# EAGLE schematic Prototype_FCC_Board_82022 (EAGLE 9.6.2)

## Sheet 1 of 3: MCU
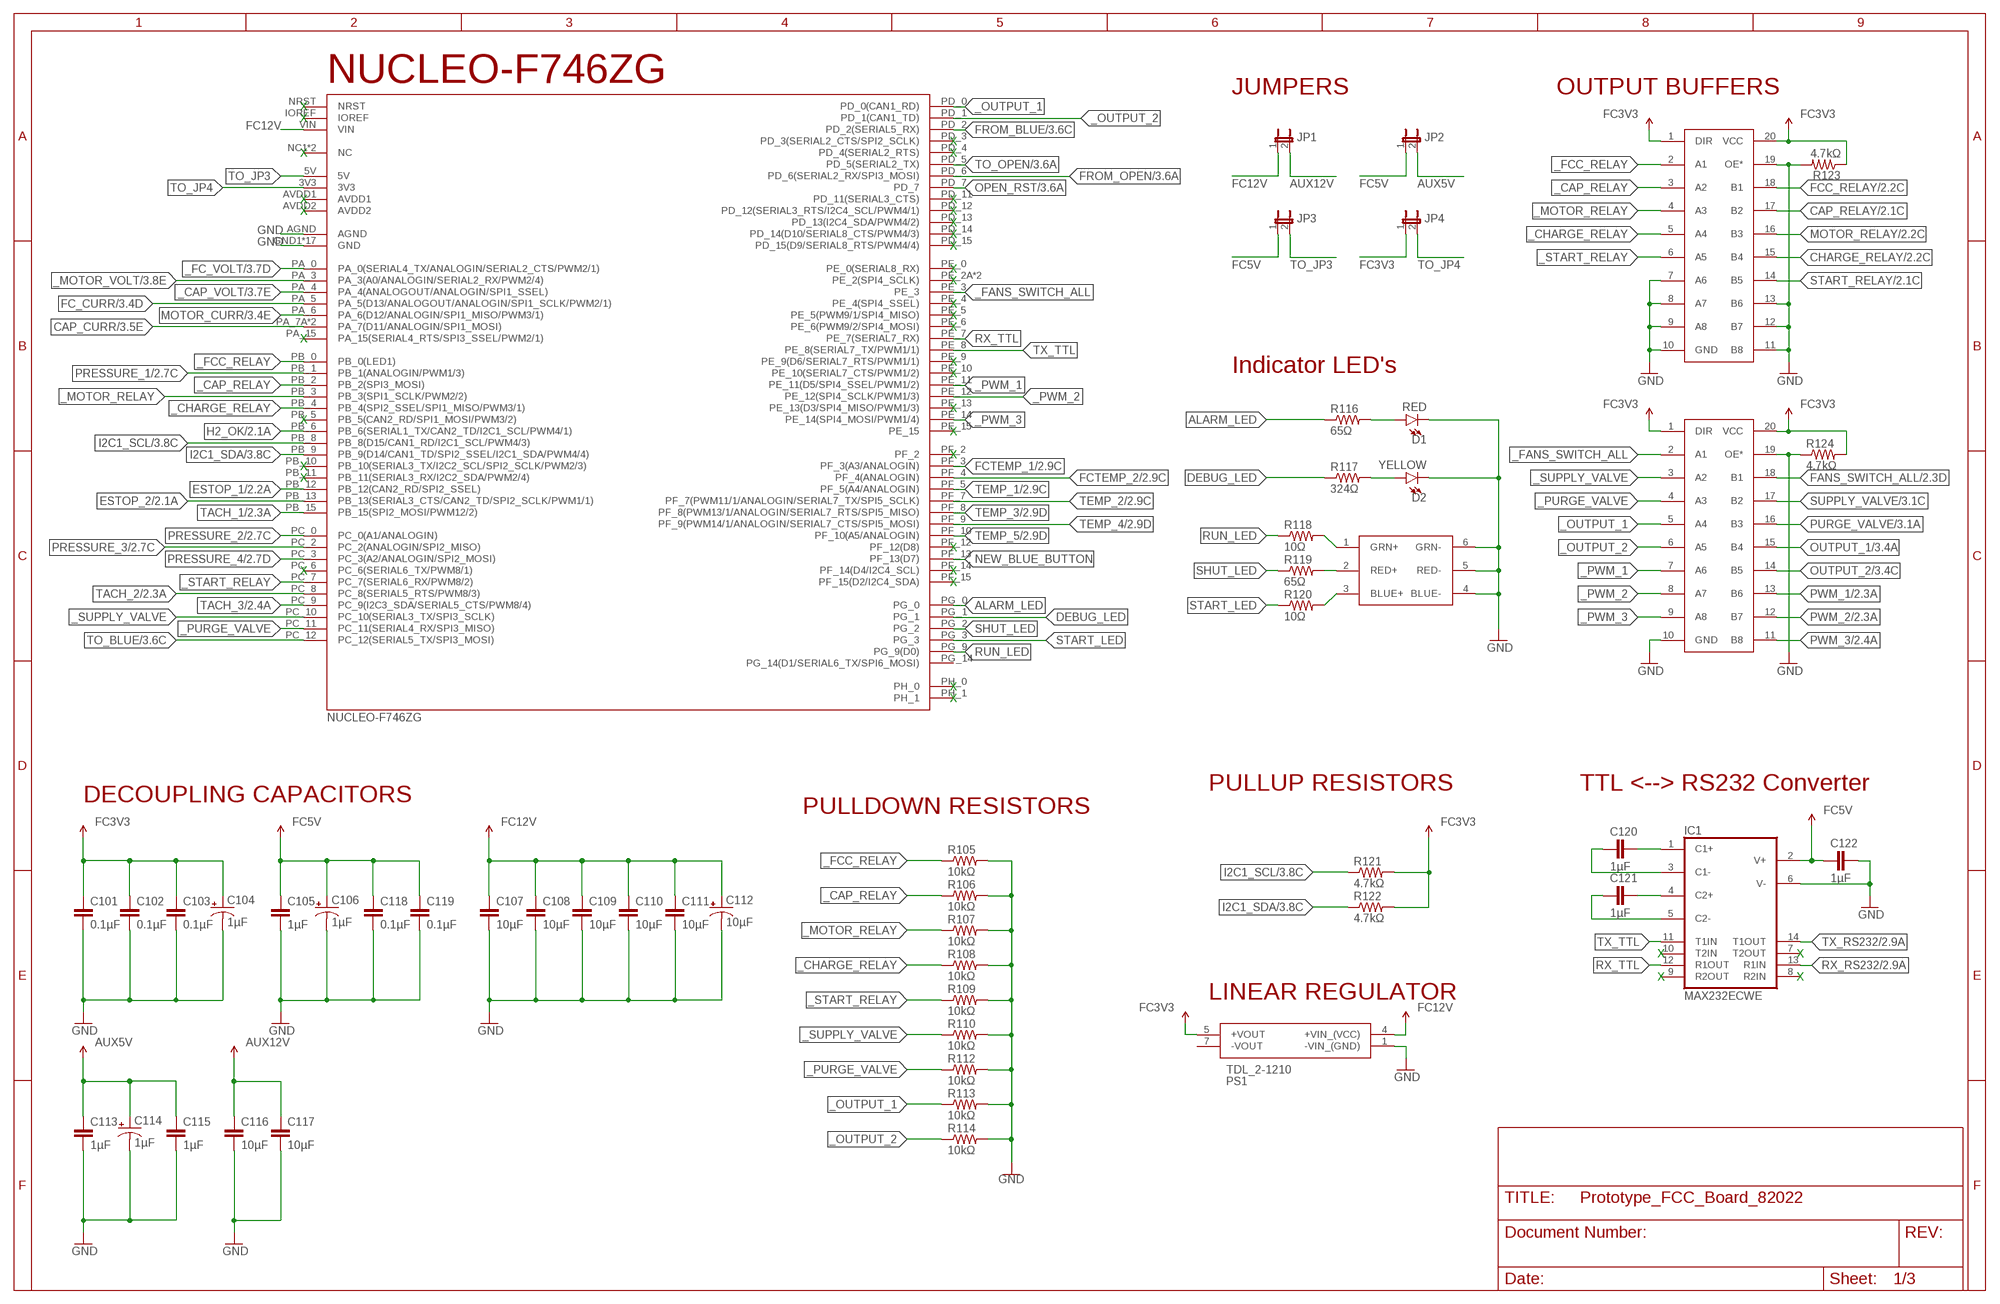
[diagram p0: schematic, sheet 1]

### Parts
C101  0.1µF  CAP0805  [0805]
C102  0.1µF  CAP0805  [0805]
C103  0.1µF  CAP0805  [0805]
C104  1µF  CAP-VS-SERIES-PACKAGE-E(ELECT)VS-SERIES-PACKAGE-E  [PANASONIC_D]
C105  1µF  CAP0805  [0805]
C106  1µF  CAP-VS-SERIES-PACKAGE-E(ELECT)VS-SERIES-PACKAGE-E  [PANASONIC_D]
C107  10µF  CAP0805  [0805]
C108  10µF  CAP0805  [0805]
C109  10µF  CAP0805  [0805]
C110  10µF  CAP0805  [0805]
C111  10µF  CAP0805  [0805]
C112  10µF  CAP-VS-SERIES-PACKAGE-E(ELECT)VS-SERIES-PACKAGE-E  [PANASONIC_D]
C113  1µF  CAP0805  [0805]
C114  1µF  CAP-VS-SERIES-PACKAGE-E(ELECT)VS-SERIES-PACKAGE-E  [PANASONIC_D]
C115  1µF  CAP0805  [0805]
C116  10µF  CAP0805  [0805]
C117  10µF  CAP0805  [0805]
C118  0.1µF  CAP0805  [0805]
C119  0.1µF  CAP0805  [0805]
C120  1µF  CAP0805  [0805]
C121  1µF  CAP0805  [0805]
C122  1µF  CAP0805  [0805]
D1  RED  LED1206  [LED-1206]
D2  YELLOW  LED1206  [LED-1206]
IC1  MAX232ECWE  [SO16L]
JP1  JP1E  [JP1]
JP2  JP1E  [JP1]
JP3  JP1E  [JP1]
JP4  JP1E  [JP1]
PS1  TDL_2-1210  [TDL21210]
R105  10kΩ  RESISTOR0805-RES  [0805]
R106  10kΩ  RESISTOR0805-RES  [0805]
R107  10kΩ  RESISTOR0805-RES  [0805]
R108  10kΩ  RESISTOR0805-RES  [0805]
R109  10kΩ  RESISTOR0805-RES  [0805]
R110  10kΩ  RESISTOR0805-RES  [0805]
R112  10kΩ  RESISTOR0805-RES  [0805]
R113  10kΩ  RESISTOR0805-RES  [0805]
R114  10kΩ  RESISTOR0805-RES  [0805]
R116  65Ω  RESISTOR0805-RES  [0805]
R117  324Ω  RESISTOR0805-RES  [0805]
R118  10Ω  RESISTOR0805-RES  [0805]
R119  65Ω  RESISTOR0805-RES  [0805]
R120  10Ω  RESISTOR0805-RES  [0805]
R121  4.7kΩ  RESISTOR0805-RES  [0805]
R122  4.7kΩ  RESISTOR0805-RES  [0805]
R123  4.7kΩ  RESISTOR0805-RES  [0805]
R124  4.7kΩ  RESISTOR0805-RES  [0805]
U$1  NUCLEO-F746ZGNUCLEO-F746ZG  [NUCLEO-F746ZG]
U$3  SN74LVC245AN  [DIL20]
U$5  SN74LVC245AN  [DIL20]
U$25  5060BRG45060BRG4  [5060BRG4]

### Nets
_CAP_RELAY: R106.1 U$1.PB_2(PB_2(SPI3_MOSI)) U$5.3(A2)
_CAP_VOLT: U$1.PA_4(PA_4(ANALOGOUT/ANALOGIN/SPI1_SSEL)) ; also sheet 3
_CHARGE_RELAY: R108.1 U$1.PB_4(PB_4(SPI2_SSEL/SPI1_MISO/PWM3/1)) U$5.5(A4)
_FANS_SWITCH_ALL: U$1.PE_3 U$3.2(A1)
_FC_VOLT: U$1.PA_0(PA_0(SERIAL4_TX/ANALOGIN/SERIAL2_CTS/PWM2/1)) ; also sheet 3
_FCC_RELAY: R105.1 U$1.PB_0(PB_0(LED1)) U$5.2(A1)
_MOTOR_RELAY: R107.1 U$1.PB_3(PB_3(SPI1_SCLK/PWM2/2)) U$5.4(A3)
_MOTOR_VOLT: U$1.PA_3(PA_3(A0/ANALOGIN/SERIAL2_RX/PWM2/4)) ; also sheet 3
_OUTPUT_1: R113.1 U$1.PD_0(PD_0(CAN1_RD)) U$3.5(A4)
_OUTPUT_2: R114.1 U$1.PD_1(PD_1(CAN1_TD)) U$3.6(A5)
_PURGE_VALVE: R112.1 U$1.PC_11(PC_11(SERIAL4_RX/SPI3_MISO)) U$3.4(A3)
_PWM_1: U$1.PE_11(PE_11(D5/SPI4_SSEL/PWM1/2)) U$3.7(A6)
_PWM_2: U$1.PE_12(PE_12(SPI4_SCLK/PWM1/3)) U$3.8(A7)
_PWM_3: U$1.PE_14(PE_14(SPI4_MOSI/PWM1/4)) U$3.9(A8)
_START_RELAY: R109.1 U$1.PC_7(PC_7(SERIAL6_RX/PWM8/2)) U$5.6(A5)
_SUPPLY_VALVE: R110.1 U$1.PC_10(PC_10(SERIAL3_TX/SPI3_SCLK)) U$3.3(A2)
ALARM_LED: R116.1 U$1.PG_0
AUX5V: C113.1 C114.+ C115.1 JP2.2 ; supply symbol labelled 5V ; also sheet 2,3
AUX12V: C116.1 C117.1 JP1.2 ; supply symbol labelled 5V ; also sheet 2,3
CAP_CURR: U$1.PA_7A(PA_7(D11/ANALOGIN/SPI1_MOSI)) U$1.PA_7B(PA_7(D11/ANALOGIN/SPI1_MOSI)) ; also sheet 3
CAP_RELAY: U$5.17(B2) ; also sheet 2
CHARGE_RELAY: U$5.15(B4) ; also sheet 2
DEBUG_LED: R117.1 U$1.PG_1
ESTOP_1: U$1.PB_12(PB_12(CAN2_RD/SPI2_SSEL)) ; also sheet 2
ESTOP_2: U$1.PB_13(PB_13(SERIAL3_CTS/CAN2_TD/SPI2_SCLK/PWM1/1)) ; also sheet 2
FANS_SWITCH_ALL: U$3.18(B1) ; also sheet 2
FC3V3: C101.1 C102.1 C103.1 C104.+ JP4.1 PS1.5(+VOUT) R121.2 R122.2 R123.1 R124.2 U$3.1(DIR) U$3.20(VCC) U$5.1(DIR) U$5.20(VCC) ; supply symbol labelled 5V ; also sheet 2,3
FC5V: C105.1 C106.+ C118.1 C119.1 C122.2 IC1.2(V+) JP2.1 JP3.1 ; supply symbol labelled 5V ; also sheet 2,3
FC12V: C107.1 C108.1 C109.1 C110.1 C111.1 C112.+ JP1.1 PS1.4(+VIN_(VCC)) U$1.VIN ; supply symbol labelled 5V ; also sheet 2,3
FC_CURR: U$1.PA_5(PA_5(D13/ANALOGOUT/ANALOGIN/SPI1_SCLK/PWM2/1)) ; also sheet 3
FCC_RELAY: U$5.18(B1) ; also sheet 2
FCTEMP_1: U$1.PF_3(PF_3(A3/ANALOGIN)) ; also sheet 2
FCTEMP_2: U$1.PF_4(PF_4(ANALOGIN)) ; also sheet 2
FROM_BLUE: U$1.PD_2(PD_2(SERIAL5_RX)) ; also sheet 3
FROM_OPEN: U$1.PD_6(PD_6(SERIAL2_RX/SPI3_MOSI)) ; also sheet 3
GND: C101.2 C102.2 C103.2 C104.- C105.2 C106.- C107.2 C108.2 C109.2 C110.2 C111.2 C112.- C113.2 C114.- C115.2 C116.2 C117.2 C118.2 C119.2 C122.1 D1.C D2.C IC1.6(V-) PS1.1(-VIN_(GND)) R105.2 R106.2 R107.2 R108.2 R109.2 R110.2 R112.2 R113.2 R114.2 R123.2 R124.1 U$1.AGND U$1.GND1(GND) U$1.GND2(GND) U$1.GND3(GND) U$1.GND4(GND) U$1.GND5(GND) U$1.GND6(GND) U$1.GND7(GND) U$1.GND8(GND) U$1.GND9(GND) U$1.GND10(GND) U$1.GND11(GND) U$1.GND12(GND) U$1.GND13(GND) U$1.GND14(GND) U$1.GND15(GND) U$1.GND16(GND) U$1.GND17(GND) U$3.10(GND) U$3.19(OE*) U$5.7(A6) U$5.8(A7) U$5.9(A8) U$5.10(GND) U$5.11(B8) U$5.12(B7) U$5.13(B6) U$5.19(OE*) U$25.4(BLUE-) U$25.5(RED-) U$25.6(GRN-) ; also sheet 2,3
H2_OK: U$1.PB_6(PB_6(SERIAL1_TX/CAN2_TD/I2C1_SCL/PWM4/1)) ; also sheet 2
I2C1_SCL: R121.1 U$1.PB_8(PB_8(D15/CAN1_RD/I2C1_SCL/PWM4/3)) ; also sheet 3
I2C1_SDA: R122.1 U$1.PB_9(PB_9(D14/CAN1_TD/SPI2_SSEL/I2C1_SDA/PWM4/4)) ; also sheet 3
MOTOR_CURR: U$1.PA_6(PA_6(D12/ANALOGIN/SPI1_MISO/PWM3/1)) ; also sheet 3
MOTOR_RELAY: U$5.16(B3) ; also sheet 2
N$16: D1.A R116.2
N$17: D2.A R117.2
N$18: R118.2 U$25.1(GRN+)
N$19: R119.2 U$25.2(RED+)
N$20: R120.2 U$25.3(BLUE+)
N$21: C120.1 IC1.1(C1+)
N$22: C120.2 IC1.3(C1-)
N$23: C121.2 IC1.4(C2+)
N$24: C121.1 IC1.5(C2-)
NEW_BLUE_BUTTON: U$1.PF_13(PF_13(D7))
OPEN_RST: U$1.PD_7 ; also sheet 3
OUTPUT_1: U$3.15(B4) ; also sheet 3
OUTPUT_2: U$3.14(B5) ; also sheet 3
PRESSURE_1: U$1.PB_1(PB_1(ANALOGIN/PWM1/3)) ; also sheet 2
PRESSURE_2: U$1.PC_0(PC_0(A1/ANALOGIN)) ; also sheet 2
PRESSURE_3: U$1.PC_2(PC_2(ANALOGIN/SPI2_MISO)) ; also sheet 2
PRESSURE_4: U$1.PC_3(PC_3(A2/ANALOGIN/SPI2_MOSI)) ; also sheet 2
PURGE_VALVE: U$3.16(B3) ; also sheet 3
PWM_1: U$3.13(B6) ; also sheet 2
PWM_2: U$3.12(B7) ; also sheet 2
PWM_3: U$3.11(B8) ; also sheet 2
RUN_LED: R118.1 U$1.PG_9(PG_9(D0))
RX_RS232: IC1.13(R1IN) ; also sheet 2
RX_TTL: IC1.12(R1OUT) U$1.PE_7(PE_7(SERIAL7_RX))
SHUT_LED: R119.1 U$1.PG_2
START_LED: R120.1 U$1.PG_3
START_RELAY: U$5.14(B5) ; also sheet 2
SUPPLY_VALVE: U$3.17(B2) ; also sheet 3
TACH_1: U$1.PB_15(PB_15(SPI2_MOSI/PWM12/2)) ; also sheet 2
TACH_2: U$1.PC_8(PC_8(SERIAL5_RTS/PWM8/3)) ; also sheet 2
TACH_3: U$1.PC_9(PC_9(I2C3_SDA/SERIAL5_CTS/PWM8/4)) ; also sheet 2
TEMP_1: U$1.PF_5(PF_5(A4/ANALOGIN)) ; also sheet 2
TEMP_2: U$1.PF_7(PF_7(PWM11/1/ANALOGIN/SERIAL7_TX/SPI5_SCLK)) ; also sheet 2
TEMP_3: U$1.PF_8(PF_8(PWM13/1/ANALOGIN/SERIAL7_RTS/SPI5_MISO)) ; also sheet 2
TEMP_4: U$1.PF_9(PF_9(PWM14/1/ANALOGIN/SERIAL7_CTS/SPI5_MOSI)) ; also sheet 2
TEMP_5: U$1.PF_10(PF_10(A5/ANALOGIN)) ; also sheet 2
TO_BLUE: U$1.PC_12(PC_12(SERIAL5_TX/SPI3_MOSI)) ; also sheet 3
TO_JP3: JP3.2 U$1.5V
TO_JP4: JP4.2 U$1.3V3
TO_OPEN: U$1.PD_5(PD_5(SERIAL2_TX)) ; also sheet 3
TX_RS232: IC1.14(T1OUT) ; also sheet 2
TX_TTL: IC1.11(T1IN) U$1.PE_8(PE_8(SERIAL7_TX/PWM1/1))
Unconnected: IC1.7(T2OUT) IC1.8(R2IN) IC1.9(R2OUT) IC1.10(T2IN) PS1.7(-VOUT) U$1.AVDD1 U$1.AVDD2 U$1.IOREF U$1.NC1(NC) U$1.NC2(NC) U$1.NRST U$1.PA_15(PA_15(SERIAL4_RTS/SPI3_SSEL/PWM2/1)) U$1.PB_5(PB_5(CAN2_RD/SPI1_MOSI/PWM3/2)) U$1.PB_10(PB_10(SERIAL3_TX/I2C2_SCL/SPI2_SCLK/PWM2/3)) U$1.PB_11(PB_11(SERIAL3_RX/I2C2_SDA/PWM2/4)) U$1.PC_6(PC_6(SERIAL6_TX/PWM8/1)) U$1.PD_3(PD_3(SERIAL2_CTS/SPI2_SCLK)) U$1.PD_4(PD_4(SERIAL2_RTS)) U$1.PD_11(PD_11(SERIAL3_CTS)) U$1.PD_12(PD_12(SERIAL3_RTS/I2C4_SCL/PWM4/1)) U$1.PD_13(PD_13(I2C4_SDA/PWM4/2)) U$1.PD_14(PD_14(D10/SERIAL8_CTS/PWM4/3)) U$1.PD_15(PD_15(D9/SERIAL8_RTS/PWM4/4)) U$1.PE_0(PE_0(SERIAL8_RX)) U$1.PE_2A(PE_2(SPI4_SCLK)) U$1.PE_2B(PE_2(SPI4_SCLK)) U$1.PE_4(PE_4(SPI4_SSEL)) U$1.PE_5(PE_5(PWM9/1/SPI4_MISO)) U$1.PE_6(PE_6(PWM9/2/SPI4_MOSI)) U$1.PE_9(PE_9(D6/SERIAL7_RTS/PWM1/1)) U$1.PE_10(PE_10(SERIAL7_CTS/PWM1/2)) U$1.PE_13(PE_13(D3/SPI4_MISO/PWM1/3)) U$1.PE_15 U$1.PF_2 U$1.PF_12(PF_12(D8)) U$1.PF_14(PF_14(D4/I2C4_SCL)) U$1.PF_15(PF_15(D2/I2C4_SDA)) U$1.PG_14(PG_14(D1/SERIAL6_TX/SPI6_MOSI)) U$1.PH_0 U$1.PH_1

### Notes on the sheet
- NUCLEO-F746ZG
- JUMPERS | OUTPUT BUFFERS
- X
- X
- X
- X | X
- X | X
- X | X
- X
- X
- X
- X
- X
- X
- X
- X
- X
- X
- X | Indicator LED's
- X
- X
- X
- X
- X
- X
- X
- X | X
- X
- X
- X
- PULLUP RESISTORS | TTL <--> RS232 Converter
- DECOUPLING CAPACITORS
- PULLDOWN RESISTORS
- X | X
- X | X
- LINEAR REGULATOR

## Sheet 2 of 3: Ethernet I/O
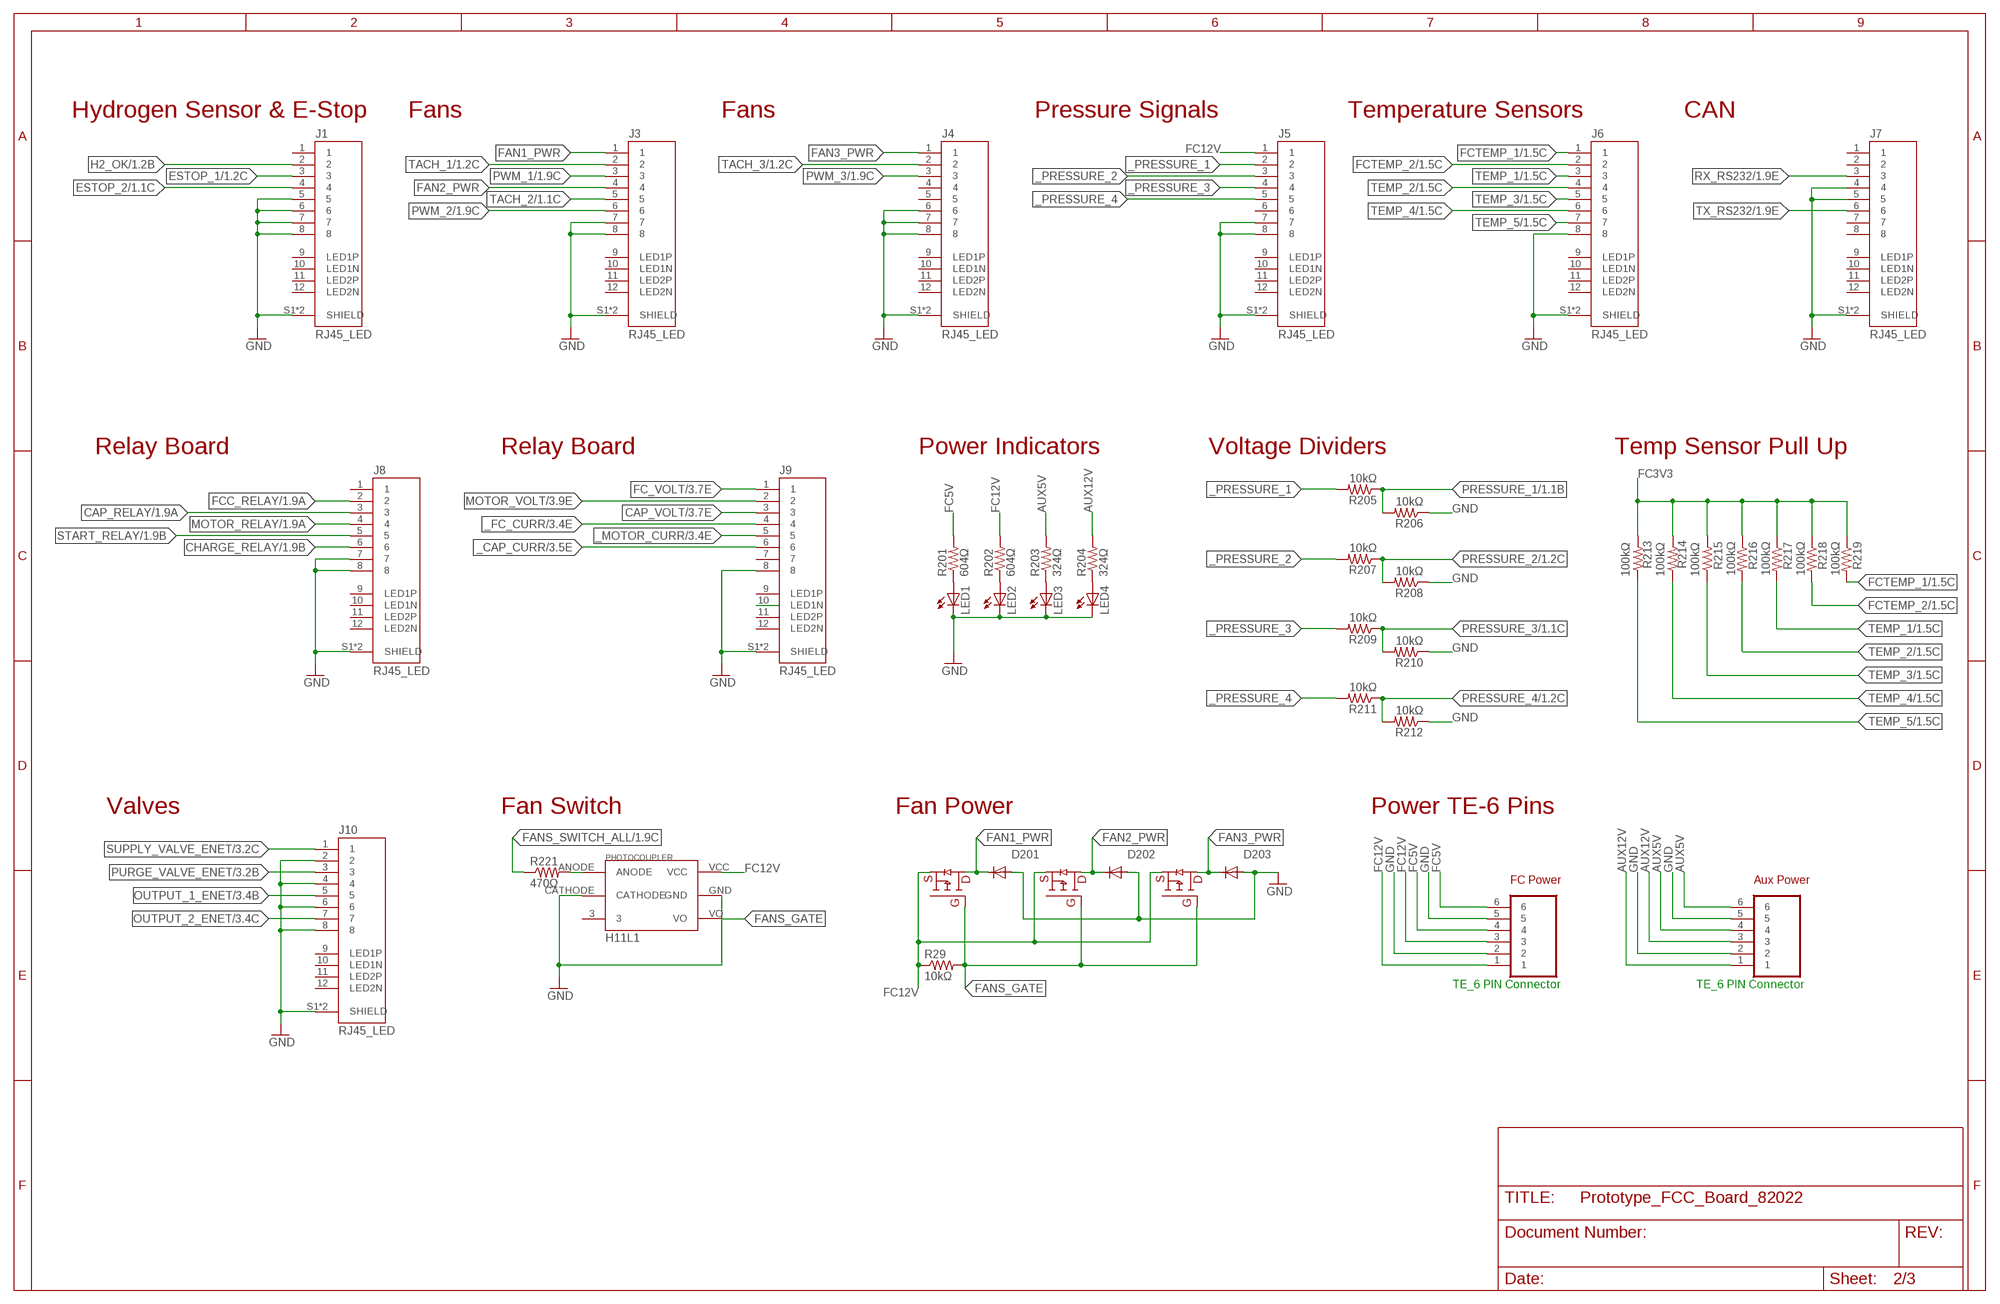
[diagram p1: schematic, sheet 2]

### Parts
AUX_PWR1  TE_6-PIN  [TE_6-PIN]
D201  DIODE-DO214AC  [DO214AC]
D202  DIODE-DO214AC  [DO214AC]
D203  DIODE-DO214AC  [DO214AC]
FC_PWR1  TE_6-PIN  [TE_6-PIN]
J1  RJ45_LED  [RJ45_LED]
J3  RJ45_LED  [RJ45_LED]
J4  RJ45_LED  [RJ45_LED]
J5  RJ45_LED  [RJ45_LED]
J6  RJ45_LED  [RJ45_LED]
J7  RJ45_LED  [RJ45_LED]
J8  RJ45_LED  [RJ45_LED]
J9  RJ45_LED  [RJ45_LED]
J10  RJ45_LED  [RJ45_LED]
LED1  LEDCHIP-LED0805  [CHIP-LED0805]
LED2  LEDCHIP-LED0805  [CHIP-LED0805]
LED3  LEDCHIP-LED0805  [CHIP-LED0805]
LED4  LEDCHIP-LED0805  [CHIP-LED0805]
R29  10kΩ  RESISTOR0805-RES  [0805]
R201  604Ω  R-US_R0805  [R0805]
R202  604Ω  R-US_R0805  [R0805]
R203  324Ω  R-US_R0805  [R0805]
R204  324Ω  R-US_R0805  [R0805]
R205  10kΩ  RESISTOR0805-RES  [0805]
R206  10kΩ  RESISTOR0805-RES  [0805]
R207  10kΩ  RESISTOR0805-RES  [0805]
R208  10kΩ  RESISTOR0805-RES  [0805]
R209  10kΩ  RESISTOR0805-RES  [0805]
R210  10kΩ  RESISTOR0805-RES  [0805]
R211  10kΩ  RESISTOR0805-RES  [0805]
R212  10kΩ  RESISTOR0805-RES  [0805]
R213  100kΩ  RESISTOR0805-RES  [0805]
R214  100kΩ  RESISTOR0805-RES  [0805]
R215  100kΩ  RESISTOR0805-RES  [0805]
R216  100kΩ  RESISTOR0805-RES  [0805]
R217  100kΩ  RESISTOR0805-RES  [0805]
R218  100kΩ  RESISTOR0805-RES  [0805]
R219  100kΩ  RESISTOR0805-RES  [0805]
R221  470Ω  RESISTOR0805-RES  [0805]
U$10  H11L1H11L1  [H11L1]
U$19  DMP3056L-7DMP3056L-7  [DMP3056L-7]
U$23  DMP3056L-7DMP3056L-7  [DMP3056L-7]
U$24  DMP3056L-7DMP3056L-7  [DMP3056L-7]

### Nets
_CAP_CURR: J9.6 ; also sheet 3
_FC_CURR: J9.4 ; also sheet 3
_MOTOR_CURR: J9.5 ; also sheet 3
_PRESSURE_1: J5.2 R205.2
_PRESSURE_2: J5.3 R207.2
_PRESSURE_3: J5.4 R209.2
_PRESSURE_4: J5.5 R211.2
AUX5V: AUX_PWR1.4 AUX_PWR1.6 R203.2 ; also sheet 1,3
AUX12V: AUX_PWR1.1 AUX_PWR1.3 R204.2 ; also sheet 1,3
CAP_RELAY: J8.3 ; also sheet 1
CAP_VOLT: J9.3 ; also sheet 3
CHARGE_RELAY: J8.6 ; also sheet 1
ESTOP_1: J1.3 ; also sheet 1
ESTOP_2: J1.4 ; also sheet 1
FAN1_PWR: D201.C J3.1 U$19.D(DRAIN)
FAN2_PWR: D202.C J3.4 U$23.D(DRAIN)
FAN3_PWR: D203.C J4.1 U$24.D(DRAIN)
FANS_GATE: R29.2 U$10.VO U$19.G(GATE) U$23.G(GATE) U$24.G(GATE)
FANS_SWITCH_ALL: R221.1 ; also sheet 1
FC3V3: R213.2 R214.2 R215.2 R216.1 R217.1 R218.1 R219.1 ; also sheet 1,3
FC5V: FC_PWR1.4 FC_PWR1.6 R201.2 ; also sheet 1,3
FC12V: FC_PWR1.1 FC_PWR1.3 J5.1 R29.1 R202.2 U$10.VCC U$19.S(SOURCE) U$23.S(SOURCE) U$24.S(SOURCE) ; also sheet 1,3
FC_VOLT: J9.1 ; also sheet 3
FCC_RELAY: J8.2 ; also sheet 1
FCTEMP_1: J6.1 R219.2 ; also sheet 1
FCTEMP_2: J6.2 R218.2 ; also sheet 1
GND: AUX_PWR1.2 AUX_PWR1.5 D201.A D202.A D203.A FC_PWR1.2 FC_PWR1.5 J1.5 J1.6 J1.7 J1.8 J1.S1(SHIELD) J1.S2(SHIELD) J3.7 J3.8 J3.S1(SHIELD) J3.S2(SHIELD) J4.6 J4.7 J4.8 J4.S1(SHIELD) J4.S2(SHIELD) J5.7 J5.8 J5.S1(SHIELD) J5.S2(SHIELD) J6.8 J6.S1(SHIELD) J6.S2(SHIELD) J7.4 J7.5 J7.S1(SHIELD) J7.S2(SHIELD) J8.7 J8.8 J8.S1(SHIELD) J8.S2(SHIELD) J9.8 J9.S1(SHIELD) J9.S2(SHIELD) J10.2 J10.4 J10.6 J10.8 J10.S1(SHIELD) J10.S2(SHIELD) LED1.C LED2.C LED3.C LED4.C R206.1 R208.1 R210.1 R212.1 U$10.CATHODE U$10.GND ; also sheet 1,3
H2_OK: J1.2 ; also sheet 1
MOTOR_RELAY: J8.4 ; also sheet 1
MOTOR_VOLT: J9.2 ; also sheet 3
N$1: LED1.A R201.1
N$3: LED2.A R202.1
N$4: LED3.A R203.1
N$5: LED4.A R204.1
N$6: J9.10(LED1N)
N$7: R221.2 U$10.ANODE
OUTPUT_1_ENET: J10.5 ; also sheet 3
OUTPUT_2_ENET: J10.7 ; also sheet 3
PRESSURE_1: R205.1 R206.2 ; also sheet 1
PRESSURE_2: R207.1 R208.2 ; also sheet 1
PRESSURE_3: R209.1 R210.2 ; also sheet 1
PRESSURE_4: R211.1 R212.2 ; also sheet 1
PURGE_VALVE_ENET: J10.3 ; also sheet 3
PWM_1: J3.3 ; also sheet 1
PWM_2: J3.6 ; also sheet 1
PWM_3: J4.3 ; also sheet 1
RX_RS232: J7.3 ; also sheet 1
START_RELAY: J8.5 ; also sheet 1
SUPPLY_VALVE_ENET: J10.1 ; also sheet 3
TACH_1: J3.2 ; also sheet 1
TACH_2: J3.5 ; also sheet 1
TACH_3: J4.2 ; also sheet 1
TEMP_1: J6.3 R217.2 ; also sheet 1
TEMP_2: J6.4 R216.2 ; also sheet 1
TEMP_3: J6.5 R215.1 ; also sheet 1
TEMP_4: J6.6 R214.1 ; also sheet 1
TEMP_5: J6.7 R213.1 ; also sheet 1
TX_RS232: J7.6 ; also sheet 1
Unconnected: J1.1 J1.9(LED1P) J1.10(LED1N) J1.11(LED2P) J1.12(LED2N) J3.9(LED1P) J3.10(LED1N) J3.11(LED2P) J3.12(LED2N) J4.4 J4.5 J4.9(LED1P) J4.10(LED1N) J4.11(LED2P) J4.12(LED2N) J5.6 J5.9(LED1P) J5.10(LED1N) J5.11(LED2P) J5.12(LED2N) J6.9(LED1P) J6.10(LED1N) J6.11(LED2P) J6.12(LED2N) J7.1 J7.2 J7.7 J7.8 J7.9(LED1P) J7.10(LED1N) J7.11(LED2P) J7.12(LED2N) J8.1 J8.9(LED1P) J8.10(LED1N) J8.11(LED2P) J8.12(LED2N) J9.7 J9.9(LED1P) J9.11(LED2P) J9.12(LED2N) J10.9(LED1P) J10.10(LED1N) J10.11(LED2P) J10.12(LED2N) U$10.3

### Notes on the sheet
- Hydrogen Sensor & E-Stop | Fans | Fans | Pressure Signals | Temperature Sensors | CAN
- Relay Board | Relay Board | Power Indicators | Voltage Dividers | Temp Sensor Pull Up
- Valves | Fan Switch | Fan Power | Power TE-6 Pins
- FC Power | Aux Power
- TE_6 PIN Connector | TE_6 PIN Connector

## Sheet 3 of 3: VALVES
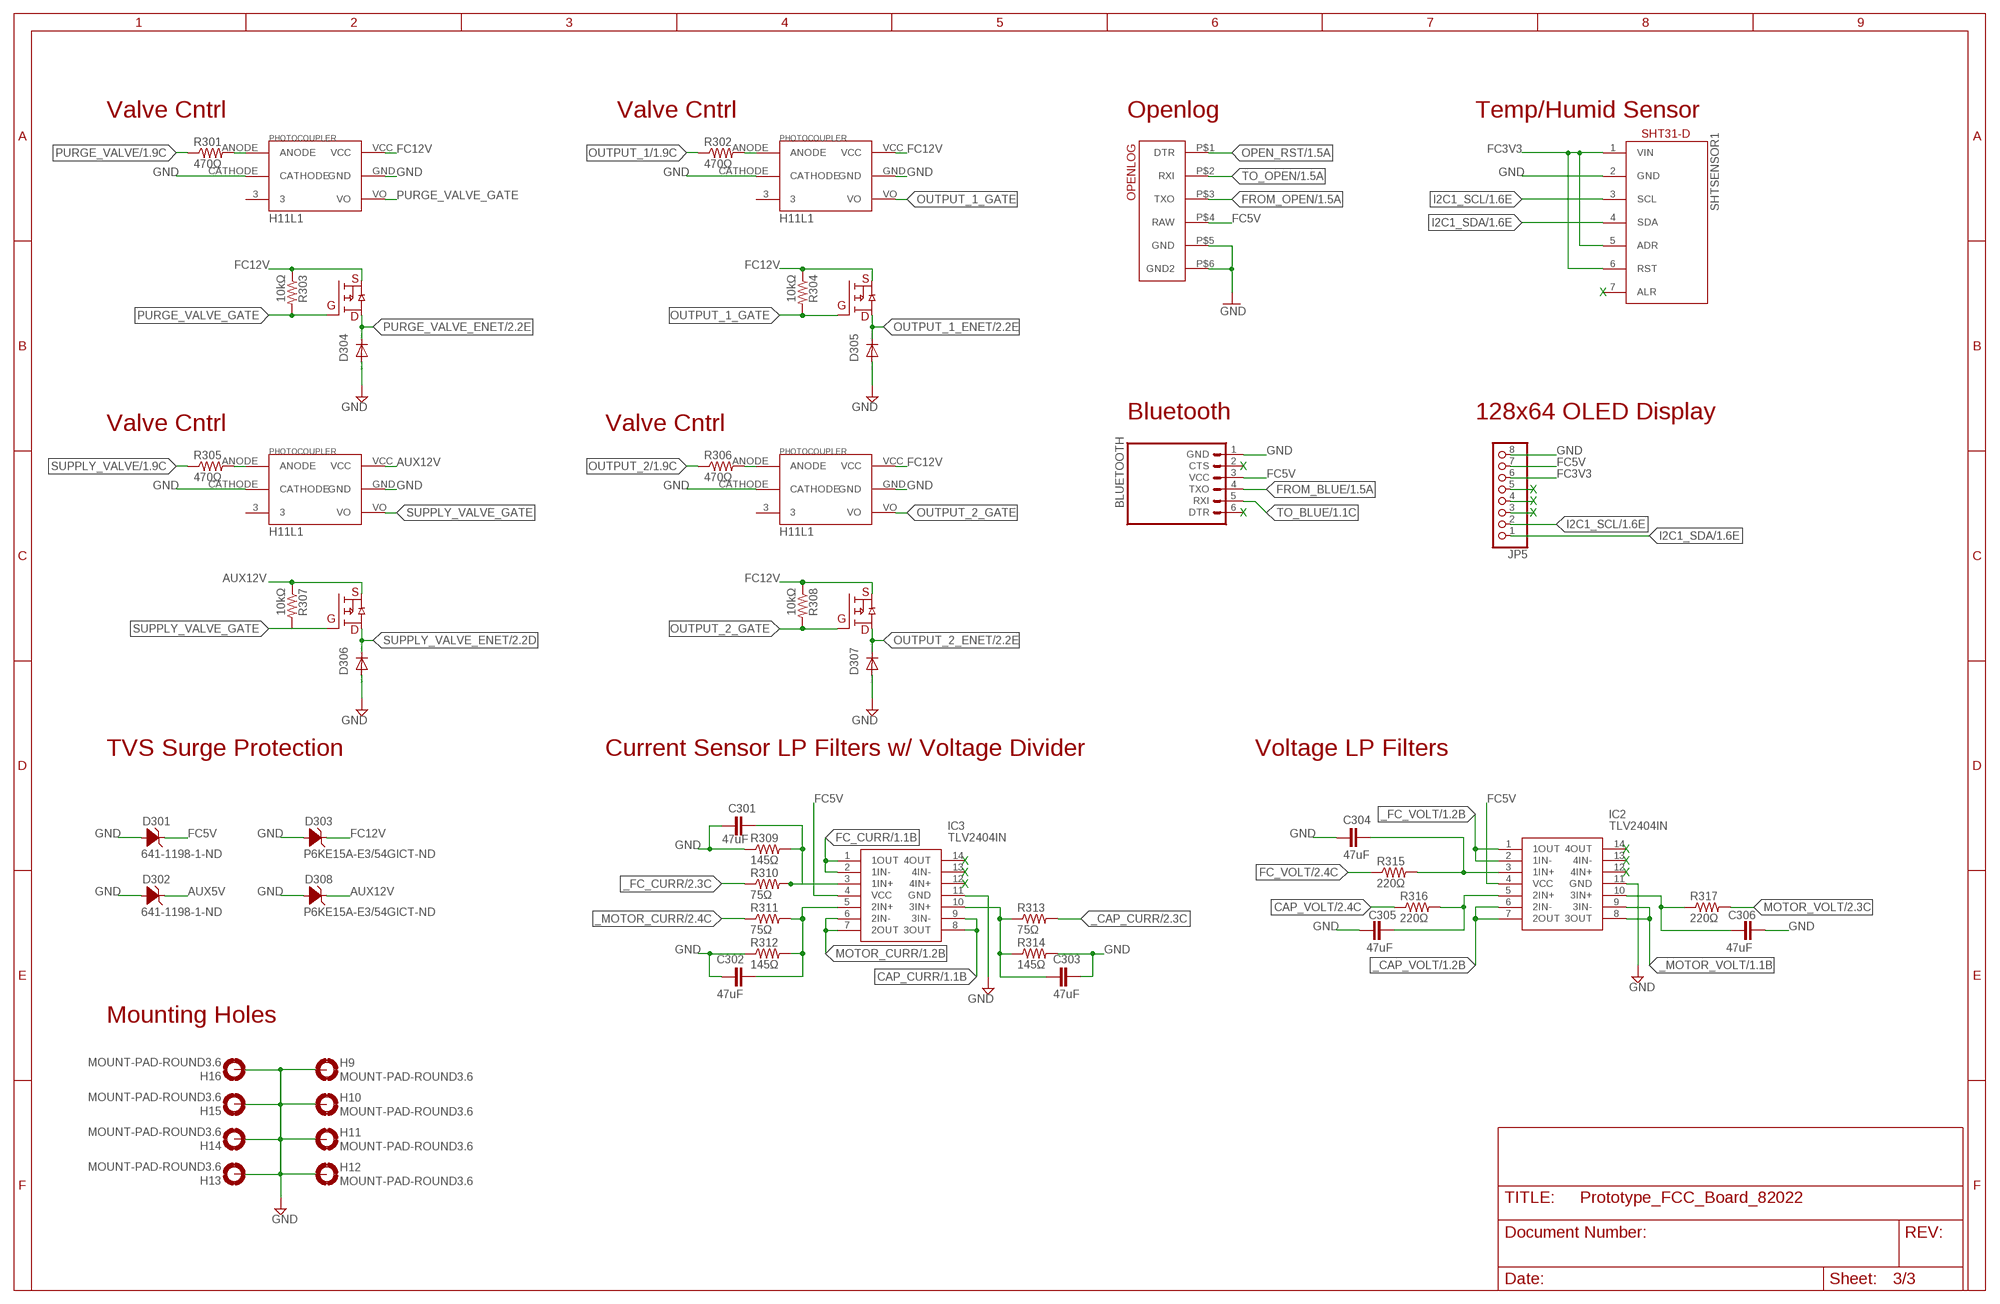
[diagram p2: schematic, sheet 3]

### Parts
C301  47uF  CAP0805  [0805]
C302  47uF  CAP0805  [0805]
C303  47uF  CAP0805  [0805]
C304  47uF  CAP0805  [0805]
C305  47uF  CAP0805  [0805]
C306  47uF  CAP0805  [0805]
D301  641-1198-1-ND  [SOT23]
D302  641-1198-1-ND  [SOT23]
D303  P6KE15A-E3/54GICT-ND  [DO-204AC]
D304  DIODE-DO214AC  [DO214AC]
D305  DIODE-DO214AC  [DO214AC]
D306  DIODE-DO214AC  [DO214AC]
D307  DIODE-DO214AC  [DO214AC]
D308  P6KE15A-E3/54GICT-ND  [DO-204AC]
H9  MOUNT-PAD-ROUND3.6  [3,6-PAD]
H10  MOUNT-PAD-ROUND3.6  [3,6-PAD]
H11  MOUNT-PAD-ROUND3.6  [3,6-PAD]
H12  MOUNT-PAD-ROUND3.6  [3,6-PAD]
H13  MOUNT-PAD-ROUND3.6  [3,6-PAD]
H14  MOUNT-PAD-ROUND3.6  [3,6-PAD]
H15  MOUNT-PAD-ROUND3.6  [3,6-PAD]
H16  MOUNT-PAD-ROUND3.6  [3,6-PAD]
IC2  TLV2404IN  [DIP794W53P254L1930H508Q14N]
IC3  TLV2404IN  [DIP794W53P254L1930H508Q14N]
J2  BLUETOOTH  [1X06BLUETOOTH]
JP5  PINHD-1X8CLEANBIG  [1X08-CLEANBIG]
R301  470Ω  RESISTOR0805-RES  [0805]
R302  470Ω  RESISTOR0805-RES  [0805]
R303  10kΩ  RESISTOR0805-RES  [0805]
R304  10kΩ  RESISTOR0805-RES  [0805]
R305  470Ω  RESISTOR0805-RES  [0805]
R306  470Ω  RESISTOR0805-RES  [0805]
R307  10kΩ  RESISTOR0805-RES  [0805]
R308  10kΩ  RESISTOR0805-RES  [0805]
R309  145Ω  R-US_R0805  [R0805]
R310  75Ω  R-US_R0805  [R0805]
R311  75Ω  R-US_R0805  [R0805]
R312  145Ω  R-US_R0805  [R0805]
R313  75Ω  R-US_R0805  [R0805]
R314  145Ω  R-US_R0805  [R0805]
R315  220Ω  R-US_R0805  [R0805]
R316  220Ω  R-US_R0805  [R0805]
R317  220Ω  R-US_R0805  [R0805]
SHTSENSOR1  SHT31-DIS  [1X07-SHT31-DIS]
U$4  OPENLOG  [OPENLOG]
U$6  H11L1H11L1  [H11L1]
U$11  H11L1H11L1  [H11L1]
U$12  DMP3056L-7DMP3056L-7  [DMP3056L-7]
U$13  DMP3056L-7DMP3056L-7  [DMP3056L-7]
U$14  H11L1H11L1  [H11L1]
U$15  DMP3056L-7DMP3056L-7  [DMP3056L-7]
U$16  H11L1H11L1  [H11L1]
U$17  DMP3056L-7DMP3056L-7  [DMP3056L-7]

### Nets
_CAP_CURR: R313.2 ; also sheet 2
_CAP_VOLT: IC2.6(2IN-) IC2.7(2OUT) ; also sheet 1
_FC_CURR: R310.1 ; also sheet 2
_FC_VOLT: IC2.1(1OUT) IC2.2(1IN-) ; also sheet 1
_MOTOR_CURR: R311.1 ; also sheet 2
_MOTOR_VOLT: IC2.8(3OUT) IC2.9(3IN-) ; also sheet 1
AUX5V: D302.C ; also sheet 1,2
AUX12V: D308.CATHODE(C) R307.1 U$6.VCC U$12.S(SOURCE) ; also sheet 1,2
CAP_CURR: IC3.8(3OUT) IC3.9(3IN-) ; also sheet 1
CAP_VOLT: R316.1 ; also sheet 2
FC3V3: JP5.6 SHTSENSOR1.1(VIN) SHTSENSOR1.5(ADR) SHTSENSOR1.6(RST) ; also sheet 1,2
FC5V: D301.C IC2.4(VCC) IC3.4(VCC) J2.3(VCC) JP5.7 U$4.P$4(RAW) ; also sheet 1,2
FC12V: D303.CATHODE(C) R303.1 R304.1 R308.1 U$11.VCC U$13.S(SOURCE) U$14.VCC U$15.S(SOURCE) U$16.VCC U$17.S(SOURCE) ; also sheet 1,2
FC_CURR: IC3.1(1OUT) IC3.2(1IN-) ; also sheet 1
FC_VOLT: R315.1 ; also sheet 2
FROM_BLUE: J2.4(TXO) ; also sheet 1
FROM_OPEN: U$4.P$3(TXO) ; also sheet 1
GND: C301.1 C302.1 C303.2 C304.2 C305.2 C306.1 D301.A1(A) D301.A2(A) D302.A1(A) D302.A2(A) D303.ANODE(A) D304.A D305.A D306.A D307.A D308.ANODE(A) H9.B3,6(MOUNT) H10.B3,6(MOUNT) H11.B3,6(MOUNT) H12.B3,6(MOUNT) H13.B3,6(MOUNT) H14.B3,6(MOUNT) H15.B3,6(MOUNT) H16.B3,6(MOUNT) IC2.11(GND) IC3.11(GND) J2.1(GND) JP5.8 R309.1 R312.1 R314.2 SHTSENSOR1.2(GND) U$4.P$5(GND) U$4.P$6(GND2) U$6.CATHODE U$6.GND U$11.CATHODE U$11.GND U$14.CATHODE U$14.GND U$16.CATHODE U$16.GND ; also sheet 1,2
I2C1_SCL: JP5.2 SHTSENSOR1.3(SCL) ; also sheet 1
I2C1_SDA: JP5.1 SHTSENSOR1.4(SDA) ; also sheet 1
MOTOR_CURR: IC3.6(2IN-) IC3.7(2OUT) ; also sheet 1
MOTOR_VOLT: R317.2 ; also sheet 2
N$2: R305.2 U$6.ANODE
N$8: C302.2 IC3.5(2IN+) R311.2 R312.2
N$9: R301.2 U$11.ANODE
N$13: R302.2 U$14.ANODE
N$14: R306.2 U$16.ANODE
N$15: C303.1 IC3.10(3IN+) R313.1 R314.1
N$25: C301.2 IC3.3(1IN+) R309.2 R310.2
N$27: C304.1 IC2.3(1IN+) R315.2
N$28: JP5.3
N$29: C306.2 IC2.10(3IN+) R317.1
N$30: JP5.4
N$31: JP5.5
N$35: C305.1 IC2.5(2IN+) R316.2
OPEN_RST: U$4.P$1(DTR) ; also sheet 1
OUTPUT_1: R302.1 ; also sheet 1
OUTPUT_1_ENET: D305.C U$15.D(DRAIN) ; also sheet 2
OUTPUT_1_GATE: R304.2 U$14.VO U$15.G(GATE)
OUTPUT_2: R306.1 ; also sheet 1
OUTPUT_2_ENET: D307.C U$17.D(DRAIN) ; also sheet 2
OUTPUT_2_GATE: R308.2 U$16.VO U$17.G(GATE)
PURGE_VALVE: R301.1 ; also sheet 1
PURGE_VALVE_ENET: D304.C U$13.D(DRAIN) ; also sheet 2
PURGE_VALVE_GATE: R303.2 U$11.VO U$13.G(GATE)
SUPPLY_VALVE: R305.1 ; also sheet 1
SUPPLY_VALVE_ENET: D306.C U$12.D(DRAIN) ; also sheet 2
SUPPLY_VALVE_GATE: R307.2 U$6.VO U$12.G(GATE)
TO_BLUE: J2.5(RXI) ; also sheet 1
TO_OPEN: U$4.P$2(RXI) ; also sheet 1
Unconnected: IC2.12(4IN+) IC2.13(4IN-) IC2.14(4OUT) IC3.12(4IN+) IC3.13(4IN-) IC3.14(4OUT) J2.2(CTS) J2.6(DTR) SHTSENSOR1.7(ALR) U$6.3 U$11.3 U$14.3 U$16.3

### Notes on the sheet
- Valve Cntrl | Valve Cntrl | Openlog | Temp/Humid Sensor
- X
- Bluetooth | 128x64 OLED Display
- Valve Cntrl | Valve Cntrl
- X
- X
- X
- X | X
- TVS Surge Protection | Current Sensor LP Filters w/ Voltage Divider | Voltage LP Filters
- X
- X | X
- X | X
- X
- Mounting Holes

## Power pins joined to a net without a drawn wire
GND: IC1.15(GND)
VCC: IC1.16(VCC)

## Library data of the parts
AUX_PWR1 FC_PWR1 = EcoCar-Connectors:TE_6-PIN: 6 Pin TE Mini-Universal MATE-N-LOK Part Number: 1-770969-0 Digikey Part Number: A32475-ND Matching Plug: A97674-ND Matching Crimps: A100828CT-ND
C101-C103 C105 C107-C111 C113 C115-C117 C120-C122 C301-C306 = SparkFun-Capacitors:CAP: Capacitor Standard 0603 ceramic capacitor, and 0.1" leaded capacitor.
C104 C106 C112 C114 = 100uF_Cap:CAP-VS-SERIES-PACKAGE-E(ELECT)
C118 C119 = SparkFun-Passives:CAP: Capacitor Standard 0603 ceramic capacitor, and 0.1" leaded capacitor.
D1 D2 = SparkFun-LED:LED: LED (Generic) Standard schematic elements and footprints for 5mm, 3mm, 1206, and 0603 sized LEDs. Generic LEDs with no color specified.
D201-D203 D304-D307 = diode:DIODE-: DIODE
D301 D302 = 5V TVS:641-1198-1-ND
D303 D308 = 12V TVS:P6KE15A-E3/54GICT-ND
H9-H16 = holes:MOUNT-PAD-ROUND: MOUNTING PAD, round
IC1 = maxim:MAX232ECWE: RS232 TRANSCEIVER; MF: MAXIM; MPN: MAX232ECWE+; OC_FARNELL: 9724435; OC_NEWARK: 67K4440
IC2 IC3 = SamacSys_Parts:TLV2404IN: Quad MicroPower, RRIO Operational Amplifier with wide supply voltage range and high CMRR Source: Datasheet <http://www.ti.com/lit/gpn/tlv2404>; DESCRIPTION: Quad MicroPower, RRIO Operational Amplifier with wide supply voltage range and high CMRR; HEIGHT: 5.08mm; MANUFACTURER_NAME: Texas Instruments; MANUFACTURER_PART_NUMBER: TLV2404IN; MOUSER_PART_NUMBER: 595-TLV2404IN; MOUSER_PRICE-STOCK: https://www.mouser.com/Search/Refine.aspx?Keyword=595-TLV2404IN
J1 J3-J10 = EcoCar-Connectors:RJ45_LED: RJ45 Connector - Use for signals and low power connections Shielded with LEDs Part Number: 6116173-1 Shielded with LEDs Digikey Part Number: A122645-ND Check availability <https://pricing.snapeda.com/parts/6116173-4/TE%20Connectivity/view-part?ref=eda>; AVAILABILITY: In Stock; COMMENT: 6116173-4; DESCRIPTION: Conn Telephone/Telecom F 8 POS 2.54mm Solder RA Thru-Hole 12 Terminal 1 Port Tray Cat 5; EU_ROHS_COMPLIANCE: Compliant; MF: TE Connectivity; MP: 6116173-4; PACKAGE: None; PRICE: None; PURCHASE-URL: https://pricing.snapeda.com/search/part/6116173-4/?ref=eda
J2 = FCC_parts:BLUETOOTH
JP1-JP4 = jumper:JP1E: JUMPER
JP5 = adafruit:PINHD-1X8: PIN HEADER
LED1-LED4 = led:LED: LED OSRAM: - CHIPLED LG R971, LG N971, LY N971, LG Q971, LY Q971, LO R971, LY R971 LH N974, LH R974 LS Q976, LO Q976, LY Q976 LO Q996 - Hyper CHIPLED LW Q18S LB Q993, LB Q99A, LB R99A - SideLED LS A670, LO A670, LY A670, LG A670, LP A670 LB A673, LV A673, LT A673, LW A673 LH A674 LY A675 LS A676, LA A676, LO A676, LY A676, LW A676 LS A679, LY A679, LG A679 - Hyper Micro SIDELED® LS Y876, LA Y876, LO Y876, LY Y876 LT Y87S - SmartLED LW L88C, LW L88S LB L89C, LB L89S, LG L890 LS L89K, LO L89K, LY L89K LS L896, LA L896, LO L896, LY L896 - TOPLED LS T670, LO T670, LY T670, LG T670, LP T670 LSG T670, LSP T670, LSY T670, LOP T670, LYG T670 LG T671, LOG T671, LSG T671 LB T673, LV T673, LT T673, LW T673 LH T674 LS T676, LA T676, LO T676, LY T676, LB T676, LH T676, LSB T676, LW T676 LB T67C, LV T67C, LT T67C, LS T67K, LO T67K, LY T67K, LW E67C LS E67B, LA E67B, LO E67B, LY E67B, LB E67C, LV E67C, LT E67C LW T67C LS T679, LY T679, LG T679 LS T770, LO T770, LY T770, LG T770, LP T770 LB T773, LV T773, LT T773, LW T773 LH T774 LS E675, LA E675, LY E675, LS T675 LS T776, LA T776, LO T776, LY T776, LB T776 LHGB T686 LT T68C, LB T68C - Hyper Mini TOPLED® LB M676 - Mini TOPLED Santana® LG M470 LS M47K, LO M47K, LY M47K Source: http://www.osram.convergy.de LUXEON: - LUMILED® LXK2-PW12-R00, LXK2-PW12-S00, LXK2-PW14-U00, LXK2-PW14-V00 LXK2-PM12-R00, LXK2-PM12-S00, LXK2-PM14-U00 LXK2-PE12-Q00, LXK2-PE12-R00, LXK2-PE12-S00, LXK2-PE14-T00, LXK2-PE14-U00 LXK2-PB12-K00, LXK2-PB12-L00, LXK2-PB12-M00, LXK2-PB14-N00, LXK2-PB14-P00, LXK2-PB14-Q00 LXK2-PR12-L00, LXK2-PR12-M00, LXK2-PR14-Q00, LXK2-PR14-R00 LXK2-PD12-Q00, LXK2-PD12-R00, LXK2-PD12-S00 LXK2-PH12-R00, LXK2-PH12-S00 LXK2-PL12-P00, LXK2-PL12-Q00, LXK2-PL12-R00 Source: www.luxeon.com KINGBRIGHT: KA-3528ASYC Source: www.kingbright.com
PS1 = SamacSys_Parts:TDL_2-1210: 2 Watt DC/DC converter, industrial, 2:1 input, cost optimzed, regulated, encapsulated, DIP package Source: Datasheet <https://componentsearchengine.com/Datasheets/1/TDL 2-1210.pdf>; DESCRIPTION: 2 Watt DC/DC converter, industrial, 2:1 input, cost optimzed, regulated, encapsulated, DIP package; HEIGHT: 8.5mm; MANUFACTURER_NAME: Traco Power; MANUFACTURER_PART_NUMBER: TDL 2-1210; MOUSER_PART_NUMBER: 495-TDL2-1210; MOUSER_PRICE-STOCK: https://www.mouser.com/Search/Refine.aspx?Keyword=495-TDL2-1210
R29 R105-R110 R112-R114 R116-R124 R205-R219 R221 R301-R308 = SparkFun-Passives:RESISTOR: Resistor Basic schematic elements and footprints for 0603, 1206, and PTH resistors.
R201-R204 R309-R317 = resistor:R-US_: RESISTOR, American symbol
SHTSENSOR1 = FCC_parts:SHT31-DIS
U$1 = FCC_parts:NUCLEO-F746ZG
U$3 U$5 = FCC_parts:SN74LVC245AN
U$4 = openlog:OPENLOG
U$6 U$10 U$11 U$14 U$16 = FCC_parts:H11L1
U$12 U$13 U$15 U$17 U$19 U$23 U$24 = FCC_parts:DMP3056L-7
U$25 = FCC_parts:5060BRG4